# EAGLE schematic x50_brakelight (EAGLE 9.2.2)
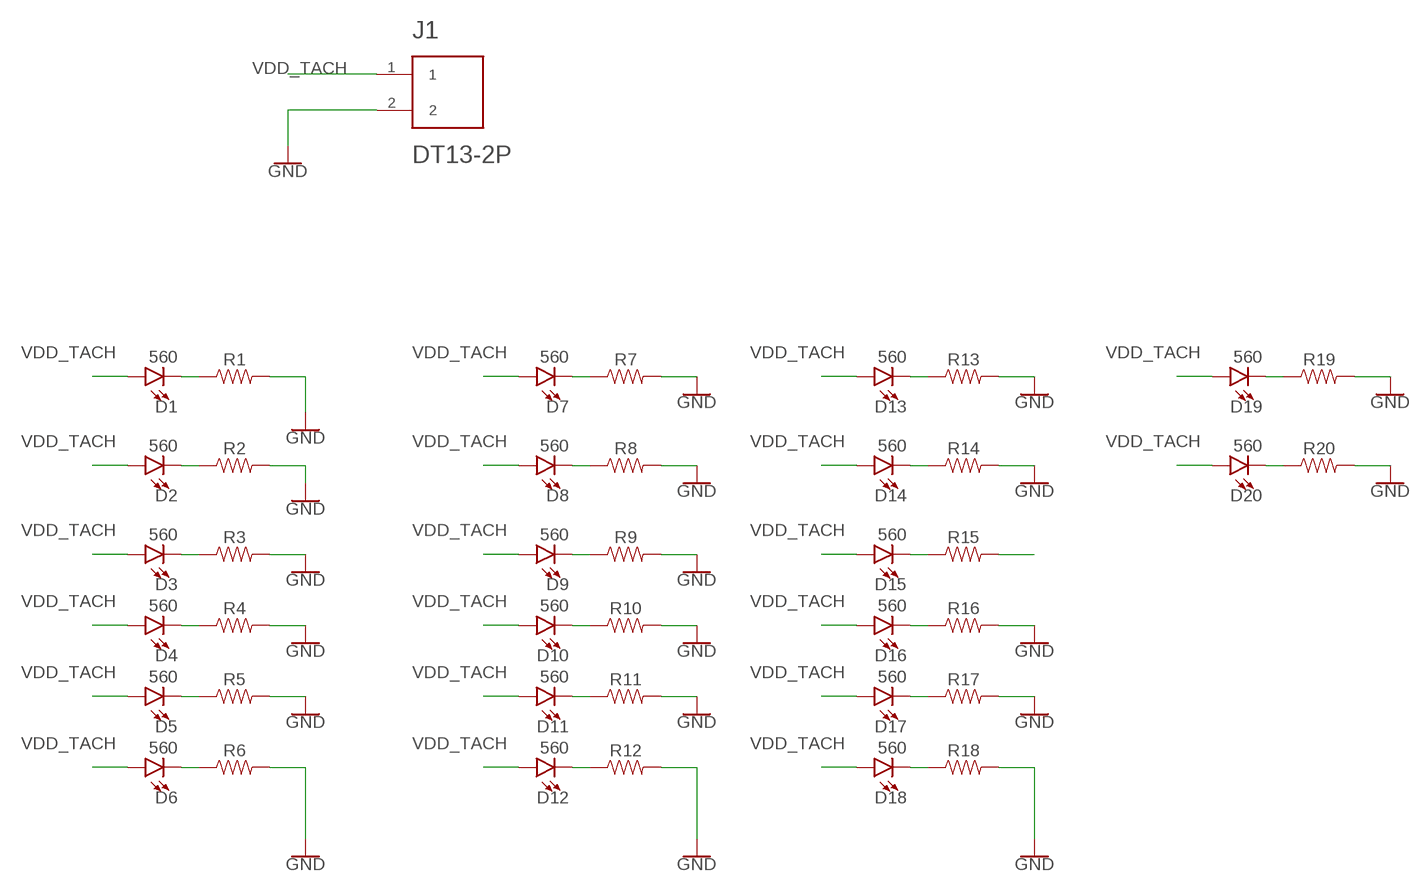
[diagram p0: schematic, sheet 1]

## Parts
D1  560  LED5MM  [LED_5MM]
D2  560  LED5MM  [LED_5MM]
D3  560  LED5MM  [LED_5MM]
D4  560  LED5MM  [LED_5MM]
D5  560  LED5MM  [LED_5MM]
D6  560  LED5MM  [LED_5MM]
D7  560  LED5MM  [LED_5MM]
D8  560  LED5MM  [LED_5MM]
D9  560  LED5MM  [LED_5MM]
D10  560  LED5MM  [LED_5MM]
D11  560  LED5MM  [LED_5MM]
D12  560  LED5MM  [LED_5MM]
D13  560  LED5MM  [LED_5MM]
D14  560  LED5MM  [LED_5MM]
D15  560  LED5MM  [LED_5MM]
D16  560  LED5MM  [LED_5MM]
D17  560  LED5MM  [LED_5MM]
D18  560  LED5MM  [LED_5MM]
D19  560  LED5MM  [LED_5MM]
D20  560  LED5MM  [LED_5MM]
J1  DT13-2P  [TE_DT13-2P]
R1  RESISTORAXIAL-0.3  [AXIAL-0.3]
R2  RESISTORAXIAL-0.3  [AXIAL-0.3]
R3  RESISTORAXIAL-0.3  [AXIAL-0.3]
R4  RESISTORAXIAL-0.3  [AXIAL-0.3]
R5  RESISTORAXIAL-0.3  [AXIAL-0.3]
R6  RESISTORAXIAL-0.3  [AXIAL-0.3]
R7  RESISTORAXIAL-0.3  [AXIAL-0.3]
R8  RESISTORAXIAL-0.3  [AXIAL-0.3]
R9  RESISTORAXIAL-0.3  [AXIAL-0.3]
R10  RESISTORAXIAL-0.3  [AXIAL-0.3]
R11  RESISTORAXIAL-0.3  [AXIAL-0.3]
R12  RESISTORAXIAL-0.3  [AXIAL-0.3]
R13  RESISTORAXIAL-0.3  [AXIAL-0.3]
R14  RESISTORAXIAL-0.3  [AXIAL-0.3]
R15  RESISTORAXIAL-0.3  [AXIAL-0.3]
R16  RESISTORAXIAL-0.3  [AXIAL-0.3]
R17  RESISTORAXIAL-0.3  [AXIAL-0.3]
R18  RESISTORAXIAL-0.3  [AXIAL-0.3]
R19  RESISTORAXIAL-0.3  [AXIAL-0.3]
R20  RESISTORAXIAL-0.3  [AXIAL-0.3]

## Nets
GND: J1.2 R1.P$2 R2.P$2 R3.P$2 R4.P$2 R5.P$2 R6.P$2 R7.P$2 R8.P$2 R9.P$2 R10.P$2 R11.P$2 R12.P$2 R13.P$2 R14.P$2 R16.P$2 R17.P$2 R18.P$2 R19.P$2 R20.P$2
N$1: D1.K(C) R1.P$1
N$2: D2.K(C) R2.P$1
N$3: D3.K(C) R3.P$1
N$4: D4.K(C) R4.P$1
N$5: D5.K(C) R5.P$1
N$6: D6.K(C) R6.P$1
N$7: D7.K(C) R7.P$1
N$8: D8.K(C) R8.P$1
N$9: D9.K(C) R9.P$1
N$10: D10.K(C) R10.P$1
N$11: D11.K(C) R11.P$1
N$12: D12.K(C) R12.P$1
N$13: D13.K(C) R13.P$1
N$14: D14.K(C) R14.P$1
N$15: D15.K(C) R15.P$1
N$16: D16.K(C) R16.P$1
N$17: D17.K(C) R17.P$1
N$18: D18.K(C) R18.P$1
N$19: D19.K(C) R19.P$1
N$20: D20.K(C) R20.P$1
N$21: R15.P$2
VDD_TACH: D1.A D2.A D3.A D4.A D5.A D6.A D7.A D8.A D9.A D10.A D11.A D12.A D13.A D14.A D15.A D16.A D17.A D18.A D19.A D20.A J1.1

## Library data of the parts
D1-D20 = SparkFun-LED:LED: LED (Generic) Standard schematic elements and footprints for 5mm, 3mm, 1206, and 0603 sized LEDs. Generic LEDs with no color specified.
J1 = DT13-2P:DT13-2P: DT13 Series, 5.46mm Pitch 2 Way 1 Row Right Angle PCB Header, Solder Termination; AVAILABILITY: In stock; DESCRIPTION: DT13 Series, 5.46mm Pitch 2 Way 1 Row Right Angle PCB Header, Solder Termination; MF: TE Connectivity; MPN: DT13-2P; PARTREV: B; STANDARD: Manufacturer recommendation
R1-R20 = SparkFun-Resistors:RESISTOR: Generic Resistor Package

## Net classes
0 default: clearance 0.205 mm
1 PWR: width 0.508 mm, drill 0.55 mm, clearance 0.205 mm to class 0, clearance 0.205 mm